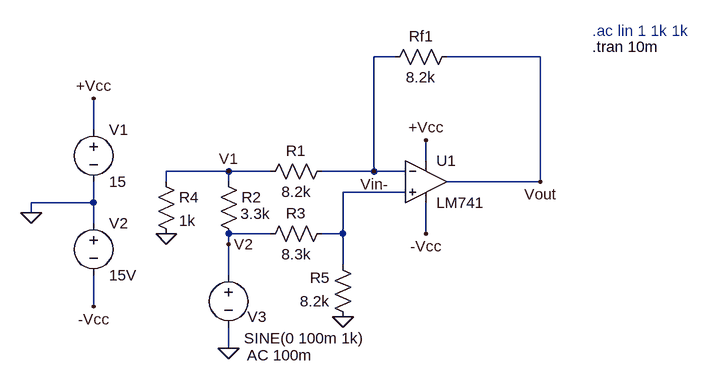
[diagram p0: schematic Subtractor.asc]
Subtractor.asc, the LTspice schematic file:
Version 4
SHEET 1 880 680
WIRE 288 16 256 16
WIRE 512 16 368 16
WIRE -176 128 -176 80
WIRE 336 176 336 144
WIRE 32 192 -64 192
WIRE 96 192 32 192
WIRE 256 192 256 16
WIRE 256 192 176 192
WIRE 304 192 256 192
WIRE -64 208 -64 192
WIRE 32 208 32 192
WIRE 512 208 512 16
WIRE 512 208 368 208
WIRE 304 224 208 224
WIRE -176 240 -176 208
WIRE -176 240 -272 240
WIRE -272 256 -272 240
WIRE -176 272 -176 240
WIRE 96 288 32 288
WIRE 208 288 208 224
WIRE 208 288 176 288
WIRE 336 288 336 240
WIRE 32 304 32 288
WIRE 208 336 208 288
WIRE 32 352 32 304
WIRE -176 400 -176 352
WIRE 32 464 32 432
FLAG -272 256 0
FLAG -176 80 +Vcc
FLAG 336 144 +Vcc
FLAG -176 400 -Vcc
FLAG 336 288 -Vcc
FLAG 512 208 Vout
FLAG 256 192 Vin-
FLAG 32 464 0
FLAG 32 192 V1
FLAG 32 304 V2
FLAG -64 288 0
FLAG 208 416 0
SYMBOL Opamps\\LM741 336 144 R0
SYMATTR InstName U1
SYMBOL res 384 0 R90
WINDOW 0 0 56 VBottom 2
WINDOW 3 32 56 VTop 2
SYMATTR InstName Rf1
SYMATTR Value 8.2k
SYMBOL res 192 176 R90
WINDOW 0 0 56 VBottom 2
WINDOW 3 32 56 VTop 2
SYMATTR InstName R1
SYMATTR Value 8.2k
SYMBOL voltage 32 336 R0
WINDOW 123 28 139 Left 2
WINDOW 39 0 0 Left 0
WINDOW 0 29 80 Left 2
WINDOW 3 24 113 Left 2
SYMATTR Value2 AC 100m
SYMATTR InstName V3
SYMATTR Value SINE(0 100m 1k)
SYMBOL voltage -176 112 R0
WINDOW 123 0 0 Left 0
WINDOW 39 0 0 Left 0
SYMATTR InstName V1
SYMATTR Value 15
SYMBOL voltage -176 256 R0
WINDOW 123 0 0 Left 0
WINDOW 39 0 0 Left 0
SYMATTR InstName V2
SYMATTR Value 15V
SYMBOL res 224 432 R180
WINDOW 0 36 76 Left 2
WINDOW 3 36 40 Left 2
SYMATTR InstName R5
SYMATTR Value 8.2k
SYMBOL res 192 272 R90
WINDOW 0 0 56 VBottom 2
WINDOW 3 32 56 VTop 2
SYMATTR InstName R3
SYMATTR Value 8.3k
SYMBOL res -80 192 R0
SYMATTR InstName R4
SYMATTR Value 1k
SYMBOL res 16 192 R0
WINDOW 3 34 65 Left 2
SYMATTR Value 3.3k
SYMATTR InstName R2
TEXT 592 -24 Left 2 ;.ac lin 1 1k 1k
TEXT 592 0 Left 2 !.tran 10m

The netlist it stands for:
* Subtractor.asc
XU1 N001 Vin- +Vcc -Vcc Vout LM741  ; pins In+ In- V+ V- OUT
Rf1 Vout Vin- 8.2k
R1 Vin- V1 8.2k
V3 V2 0 SINE(0 100m 1k) AC 100m
V1 +Vcc 0 15
V2 0 -Vcc 15V
R5 0 N001 8.2k
R3 N001 V2 8.3k
R4 V1 0 1k
R2 V1 V2 3.3k
* .ac lin 1 1k 1k
.tran 10m
.lib LM741.lib
.backanno
.end